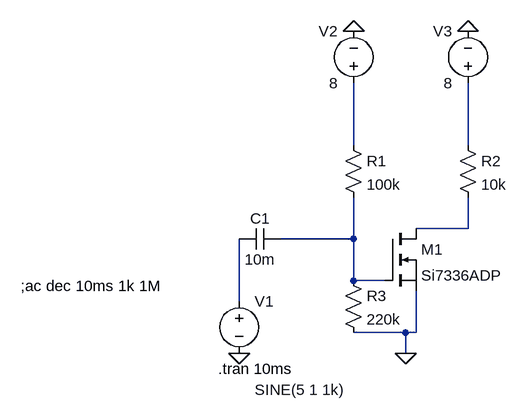
[diagram p0: schematic Part2.asc]
Part2.asc, the LTspice schematic file:
Version 4
SHEET 1 880 680
WIRE 288 -112 288 -208
WIRE 464 -112 464 -208
WIRE 464 16 464 -32
WIRE 464 16 384 16
WIRE 288 32 288 -32
WIRE 288 32 176 32
WIRE 288 96 288 32
WIRE 336 96 288 96
WIRE 112 128 112 32
WIRE 368 176 288 176
WIRE 384 176 384 112
WIRE 384 176 368 176
WIRE 368 208 368 176
FLAG 112 208 0
FLAG 368 208 0
FLAG 288 -288 0
FLAG 464 -288 0
SYMBOL cap 176 16 R90
WINDOW 0 0 32 VBottom 2
WINDOW 3 32 32 VTop 2
SYMATTR InstName C1
SYMATTR Value 10m
SYMBOL res 272 -128 R0
SYMATTR InstName R1
SYMATTR Value 100k
SYMBOL res 448 -128 R0
SYMATTR InstName R2
SYMATTR Value 10k
SYMBOL res 272 80 R0
SYMATTR InstName R3
SYMATTR Value 220k
SYMBOL voltage 288 -192 R180
WINDOW 0 24 96 Left 2
WINDOW 3 24 16 Left 2
WINDOW 123 0 0 Left 0
WINDOW 39 0 0 Left 0
SYMATTR InstName V2
SYMATTR Value 8
SYMBOL voltage 464 -192 R180
WINDOW 0 24 96 Left 2
WINDOW 3 24 16 Left 2
WINDOW 123 0 0 Left 0
WINDOW 39 0 0 Left 0
SYMATTR InstName V3
SYMATTR Value 8
SYMBOL nmos 336 16 R0
SYMATTR InstName M1
SYMATTR Value Si7336ADP
SYMBOL voltage 112 112 R0
WINDOW 3 24 152 Left 2
WINDOW 123 24 124 Left 2
WINDOW 39 0 0 Left 0
SYMATTR InstName V1
SYMATTR Value SINE(5 1 1k)
TEXT 80 232 Left 2 !.tran 10ms
TEXT -224 104 Left 2 !;ac dec 10ms 1k 1M

The netlist it stands for:
* Part2.asc
C1 N004 N005 10m
R1 N001 N004 100k
R2 N002 N003 10k
R3 N004 0 220k
V2 N001 0 8
V3 N002 0 8
M1 N003 N004 0 0 Si7336ADP
V1 N005 0 SINE(5 1 1k)
.model NMOS NMOS
.model PMOS PMOS
.lib standard.mos
.tran 10ms
;ac dec 10ms 1k 1M
.backanno
.end